# Altium project mcHFPro_rf.PrjPcb (part 2 of 2)

## Sheet rf_swrmet.SchDoc: mcHF Pro Transceiver RF board
size A3; Author: Krassi Atanassov; CompanyName: MØNKA; Engineer: For radio amateurs experimentation, non-commercial use only. Thank you!; Revision: 0.8.5; SheetTotal: 14
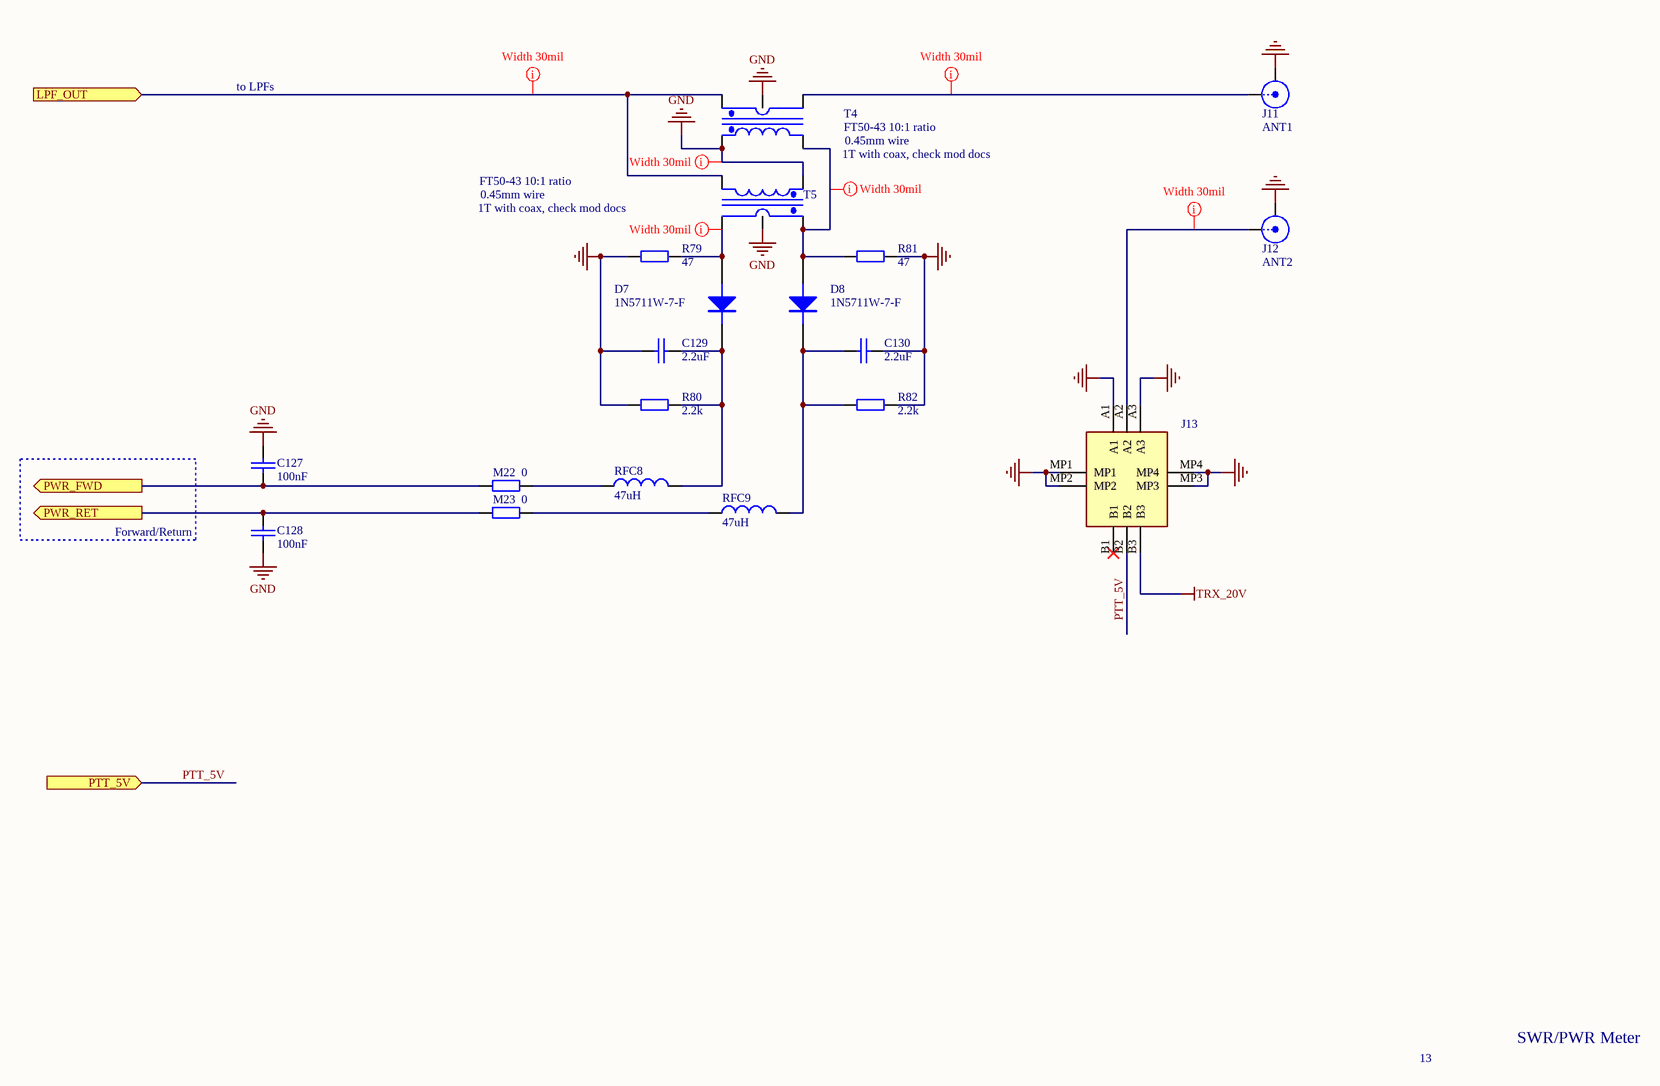
[diagram p13: rf_swrmet.SchDoc]

### Parts
C127  100nF  [0805]
C128  100nF  [0805]
C129  2.2uF  [0805]
C130  2.2uF  [0805]
D7  1N5711W-7-F  [SOD87]
D8  1N5711W-7-F  [SOD87]
J11  ANT1  [CON-SMA-RA]
J12  ANT2  [CON-SMA-RA]
J13  1373826  [1373826]  (value not drawn)
M22  0  [0805]
M23  0  [0805]
R79  47  [0805]
R80  2.2k  [0805]
R81  47  [0805]
R82  2.2k  [0805]
RFC8  47uH  [0805]
RFC9  47uH  [0805]
T4  FT50-43 10:1 ratio  [SWR_TR _new]
T5  FT50-43 10:1 ratio  [SWR_TR _new]

### Ports
LPF_OUT (in), PTT_5V (in), PWR_FWD (out), PWR_RET (out)

### Nets
GND: C127.1 C128.2 C129.1 C130.2 J11.2(Y) J12.2(Y) J13.A1 J13.A3 J13.MP1 J13.MP2 J13.MP3 J13.MP4 R79.1 R80.1 R81.2 R82.2 T4.1(Pri+) T4.5(Shield) T5.1(Pri+) T5.5(Shield)
TRX_20V: J13.B3
PTT_5V: J13.B2 ; port PTT_5V
PWR_FWD: C127.2 M22.2 ; port PWR_FWD
PWR_RET: C128.1 M23.2 ; port PWR_RET
NetC129_2: C129.2 D7.2(K) R80.2 RFC8.2
NetC130_1: C130.1 D8.2(K) R82.1 RFC9.2
NetD7_1: D7.1(A) R79.2 T5.4(Sec-)
NetD8_1: D8.1(A) R81.1 T4.2(Pri-) T5.3(Sec+)
NetJ11_1: J11.1(X) T4.4(Sec-)
NetJ12_1: J12.1(X) J13.A2
NetM12_2: T4.3(Sec+) T5.2(Pri-) ; port LPF_OUT
NetM22_1: M22.1 RFC8.1
NetM23_1: M23.1 RFC9.1

Not connected (* = marked no-connect by the designer): J13 B1*

### Layout directives
rule Width Constraint [Pref Width = 30mil    Min Width = 30mil    Max Width = 30mil]: GND, NetD7_1, NetD8_1, NetJ11_1, NetJ12_1, NetM12_2

### Notes on the sheet
- to LPFs
- 0.45mm wire
- 1T with coax, check mod docs
- (near R79) 1T with coax, check mod docs
- Forward/Return
- 13
- SWR/PWR Meter
- Date:
- File:
- Revision:
- Sheet
- of
- Licence:

### Library data of the parts
C127 C128 = CAP: Capacitor; QT Order: QCC-00154; Price: 0.068
C129 C130 = CAP: Capacitor; QT Order: QCC-00103; Price: 0.115
D7 D8 = PMEG6010CEH: RF DIODE SCHOTTKY 70V, SOD-123F; Order: DK 1N5711W-FDITR-ND; QT Order: QCD-00034; Price: 0.085
J11 J12 = BNC: RF COAXIAL, BNC, JACK; Order: FN 171-2350; Price: 0.69
J13 = 1373826: SMD male connector, nominal current: 2.2 A, Test voltage: 840 VAC, number of positions: 6, pitch: 1.27 mm, color: black, contact surface: Gold, type of contact: Male connector, mounting: SMD soldering; Manufacturer_Name: Phoenix Contact; Geometry.Height: 6.75mm; Mouser Part Number: 651-1373826; Mouser Price/Stock: https://www.mouser.co.uk/ProductDetail/Phoenix-Contact/1373826?qs=2SLPxufLcgB13Clq%252BEBMrA%3D%3D; Manufacturer_Part_Number: 1373826; Datasheet Link: http://www.phoenixcontact.com/gb/produkte/1373826
M22 M23 = RES: Resistor; QT Order: QCR-00268; Price: 0.009
R79 R81 = RES: Resistor; QT Order: QCR-00293; Price: 0.052
R80 R82 = RES: Resistor; QT Order: QCR-00333; Price: 0.046
RFC8 RFC9 = TDK-NLV25T: INDUCTOR, SIGNAL LINE, 47UH, 1005; Price: 0.166
T4 T5 = SWR_TR: SWR Bridge transformer; Notes: post assembly; Price: 0.795

## Nets that join several sheets
GND: rf_tx_pa (41 pins), rf_bpf (30 pins), rf_lpf (11 pins), rf_lpf_30_20 (C56.1 C57.1 C58.1 C60.1), rf_lpf_60_40 (C61.1 C62.1 C63.1 C65.1), rf_lpf_80 (C66.2 C67.2 C68.2 C70.2), rf_lpf_160 (C71.2 C72.2 C73.2 C75.2), rf_lpf_17_10 (5 pins), rf_conn (35 pins), rf_bms (21 pins), rf_smps (36 pins), rf_trsw (C132.1 C133.2 K5.4 Q8.2), rf_swrmet (20 pins)
PACK_P: rf_tx_pa (C104.1 C105.2 R54.2 RFC5.1), rf_conn (M9.2), rf_bms (Q7.3 R73.2), rf_smps (5 pins)
TRX_20V: rf_tx_pa (5 pins), rf_swrmet (J13.B3)
VBAT_F: rf_conn (R500.1), rf_bms (D6.1 F2.2 Q6.2)
VCC_5V: rf_tx_pa (C116.2 R60.1), rf_bpf (10 pins), rf_lpf (M13.2), rf_conn (5 pins), rf_smps (M20.1), rf_trsw (M10.2)
VCC_8V: rf_tx_pa (5 pins), rf_smps (M21.1)
ANT_TX_ON: rf_conn (U3.1), rf_trsw (R85.1)
BAND0: rf_bpf (M5.1), rf_lpf (M14.1), rf_conn (J3RF.A18)
BAND1: rf_bpf (M6.1), rf_lpf (M15.1), rf_conn (J3RF.A17)
BAND2: rf_lpf (M16.1), rf_conn (J1RF.A3)
BAND3: rf_lpf (M17.1), rf_conn (J1RF.A2)
BMS_PRES: rf_conn (J1RF.A4), rf_bms (R76.2)
BMS_PWM: rf_conn (J3RF.A8), rf_bms (R76f.2)
BMS_SCL: rf_conn (J1RF.A6), rf_bms (R74.2)
BMS_SDA: rf_conn (J1RF.A5), rf_bms (R75.2)
BST_EN: rf_conn (J1RF.A17), rf_smps (R200.1)
NetC48_2: rf_lpf (K4.3 K4.6), rf_lpf_17_10 (C48.2 C49.2 L13.1)
NetC54_1: rf_lpf (M12.1), rf_lpf_17_10 (C54.1 C55.2 L15.2)
NetC56_2: rf_lpf (K1.5), rf_lpf_30_20 (C56.2 L16.1)
NetC59_1: rf_lpf (K2.3), rf_lpf_30_20 (C59.1 C60.2 L18.2)
NetC61_2: rf_lpf (K2.2), rf_lpf_60_40 (C61.2 L19.1)
NetC64_1: rf_lpf (K3.7), rf_lpf_60_40 (C64.1 C65.2 L21.2)
NetC66_1: rf_lpf (K3.3), rf_lpf_80 (C66.1 L22.1)
NetC69_1: rf_lpf (K4.2), rf_lpf_80 (C69.1 C70.1 L24.2)
NetC71_1: rf_lpf (K2.5), rf_lpf_160 (C71.1 L25.1)
NetC74_1: rf_lpf (K3.4), rf_lpf_160 (C74.1 C75.1 L27.2)
NetC91_2: rf_tx_pa (C91.2), rf_bpf (M3.1)
NetC136_1: rf_bpf (M1.2), rf_trsw (C136.1)
NetK5_5: rf_tx_pa (T3.4), rf_trsw (K5.5)
NetK5_6: rf_lpf (M11.2), rf_trsw (K5.6)
NetM12_2: rf_lpf (M12.2), rf_swrmet (T4.3 T5.2)
PA_BIAS0: rf_tx_pa (C110.1 R55.1), rf_conn (J1RF.A20)
PA_BIAS1: rf_tx_pa (C111.2 R56.1), rf_conn (J1RF.A19)
PA_TEMP: rf_tx_pa (C117.1 R60.2 R61.1), rf_conn (J3RF.A16)
PTT_5V: rf_tx_pa (D5.2), rf_bpf (M7.1), rf_conn (U3.13), rf_swrmet (J13.B2)
PTT_N5V: rf_tx_pa (U10.5 U11.5), rf_bpf (M8.1), rf_conn (U3.10 U3.11 U3.12)
PWR_FWD: rf_conn (J1RF.A10), rf_swrmet (C127.2 M22.2)
PWR_RET: rf_conn (J1RF.A9), rf_swrmet (C128.1 M23.2)
RX_QSD_IN: rf_bpf (M4.1), rf_conn (J3RF.A10)
TX_MIX: rf_bpf (M2.2), rf_conn (J3RF.A9)
VCC_58V_ON: rf_conn (J1RF.A16), rf_smps (R39.1)